# Altium schematic sheet ekstralar.SchDoc
size A4; SheetNumber: 7; SheetTotal: 10
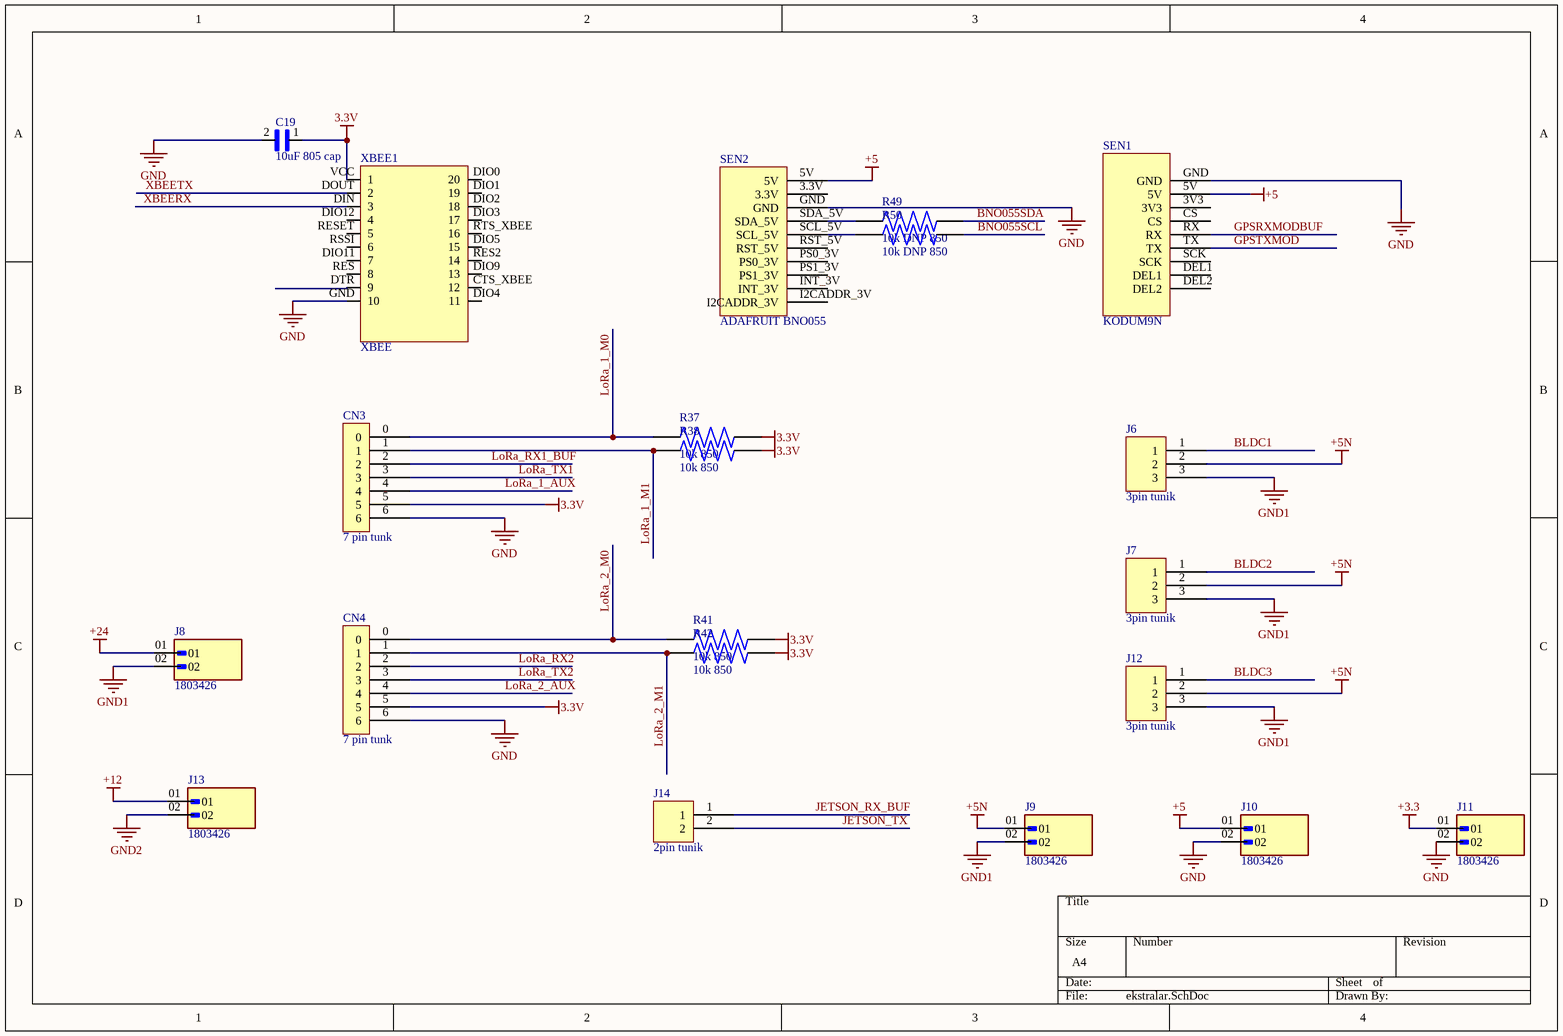
[diagram p0: ekstralar.SchDoc]

## Parts
C19  10uF 805 cap  [1uF 805 Cap]
CN3  7 pin tunk  [7 pin tunik]
CN4  7 pin tunk  [7 pin tunik]
J6  3pin tunik  [3pin tunik]
J7  3pin tunik  [3pin tunik]
J8  1803426  [PHOENIX_1803426]
J9  1803426  [PHOENIX_1803426]
J10  1803426  [PHOENIX_1803426]
J11  1803426  [PHOENIX_1803426]
J12  3pin tunik  [3pin tunik]
J13  1803426  [PHOENIX_1803426]
J14  2pin tunik  [2pin tunşk]
R37  10k 850  [10k 850]
R38  10k 850  [10k 850]
R41  10k 850  [10k 850]
R42  10k 850  [10k 850]
R49  10k DNP 850  [10k 850]
R50  10k DNP 850  [10k 850]
SEN1  KODUM9N  [KODUM9N]
SEN2  ADAFRUIT BNO055  [ADAFRUIT BNO055]
XBEE1  XBEE  [xbee_1]

## Nets
3.3V: C19.1 CN3.5 CN4.5 R37.1 R38.1 R41.1 R42.1 XBEE1.VCC(1)
+3.3: J11.01
+5: J10.01 SEN1.5V SEN2.5V
+5N: J6.2 J7.2 J9.01 J12.2
+12: J13.01
+24: J8.01
GND: C19.2 CN3.6 CN4.6 J10.02 J11.02 SEN1.GND SEN2.GND XBEE1.GND(10)
GND1: J6.3 J7.3 J8.02 J9.02 J12.3
GND2: J13.02
BLDC1: J6.1
BLDC2: J7.1
BLDC3: J12.1
BNO055SCL: R50.2
BNO055SDA: R49.2
GPSRXMODBUF: SEN1.RX
GPSTXMOD: SEN1.TX
JETSON_RX_BUF: J14.1
JETSON_TX: J14.2
LoRa_1_AUX: CN3.4
LoRa_1_M0: CN3.0 R37.2
LoRa_1_M1: CN3.1 R38.2
LoRa_2_AUX: CN4.4
LoRa_2_M0: CN4.0 R41.2
LoRa_2_M1: CN4.1 R42.2
LoRa_RX1_BUF: CN3.2
LoRa_RX2: CN4.2
LoRa_TX1: CN3.3
LoRa_TX2: CN4.3
XBEERX: XBEE1.DIN(3)
XBEETX: XBEE1.DOUT(2)
NetR49_1: R49.1 SEN2.SDA_5V
NetR50_1: R50.1 SEN2.SCL_5V

Not connected (* = marked no-connect by the designer): SEN1 3V3 CS DEL1 DEL2 SCK; SEN2 3.3V I2CADDR_3V INT_3V PS0_3V PS1_3V RST_5V; XBEE1 CTS_XBEE(12) DIO0(20) DIO1(19) DIO2(18) DIO3(17) DIO4(11) DIO5(15) DIO9(13) DIO11(7) DIO12(4) DTR(9) RES(8) RES2(14) RESET(5) RSSI(6) RTS_XBEE(16)

## Library data of the parts
C19 = 1uF 805 cap
J8-J11 J13 = 1803426: Pluggable Header 3.81mm 16AWG 160V 8A 2 Position COMBICON MCV Series | Phoenix Contact 1803426; SnapEDA_Link: https://www.snapeda.com/parts/1803426/Phoenix+Contact/view-part/?ref=snap; Package: None; Value: *; MF: Phoenix Contact; MP: 1803426; Check_prices: https://www.snapeda.com/parts/1803426/Phoenix+Contact/view-part/?ref=eda
R49 R50 = 10k 850